# Altium schematic sheet MB_FPGA.SchDoc
size 420 x 297 mm; Date: 18/12/2022; ApprovedBy: UA3REO; CheckedBy: UA3REO; Author: RU4PN; CompanyName: Wolf Teams; DocumentNumber: Wolf2 MainBoard FPGA; SheetNumber: 2; SheetTotal: 7
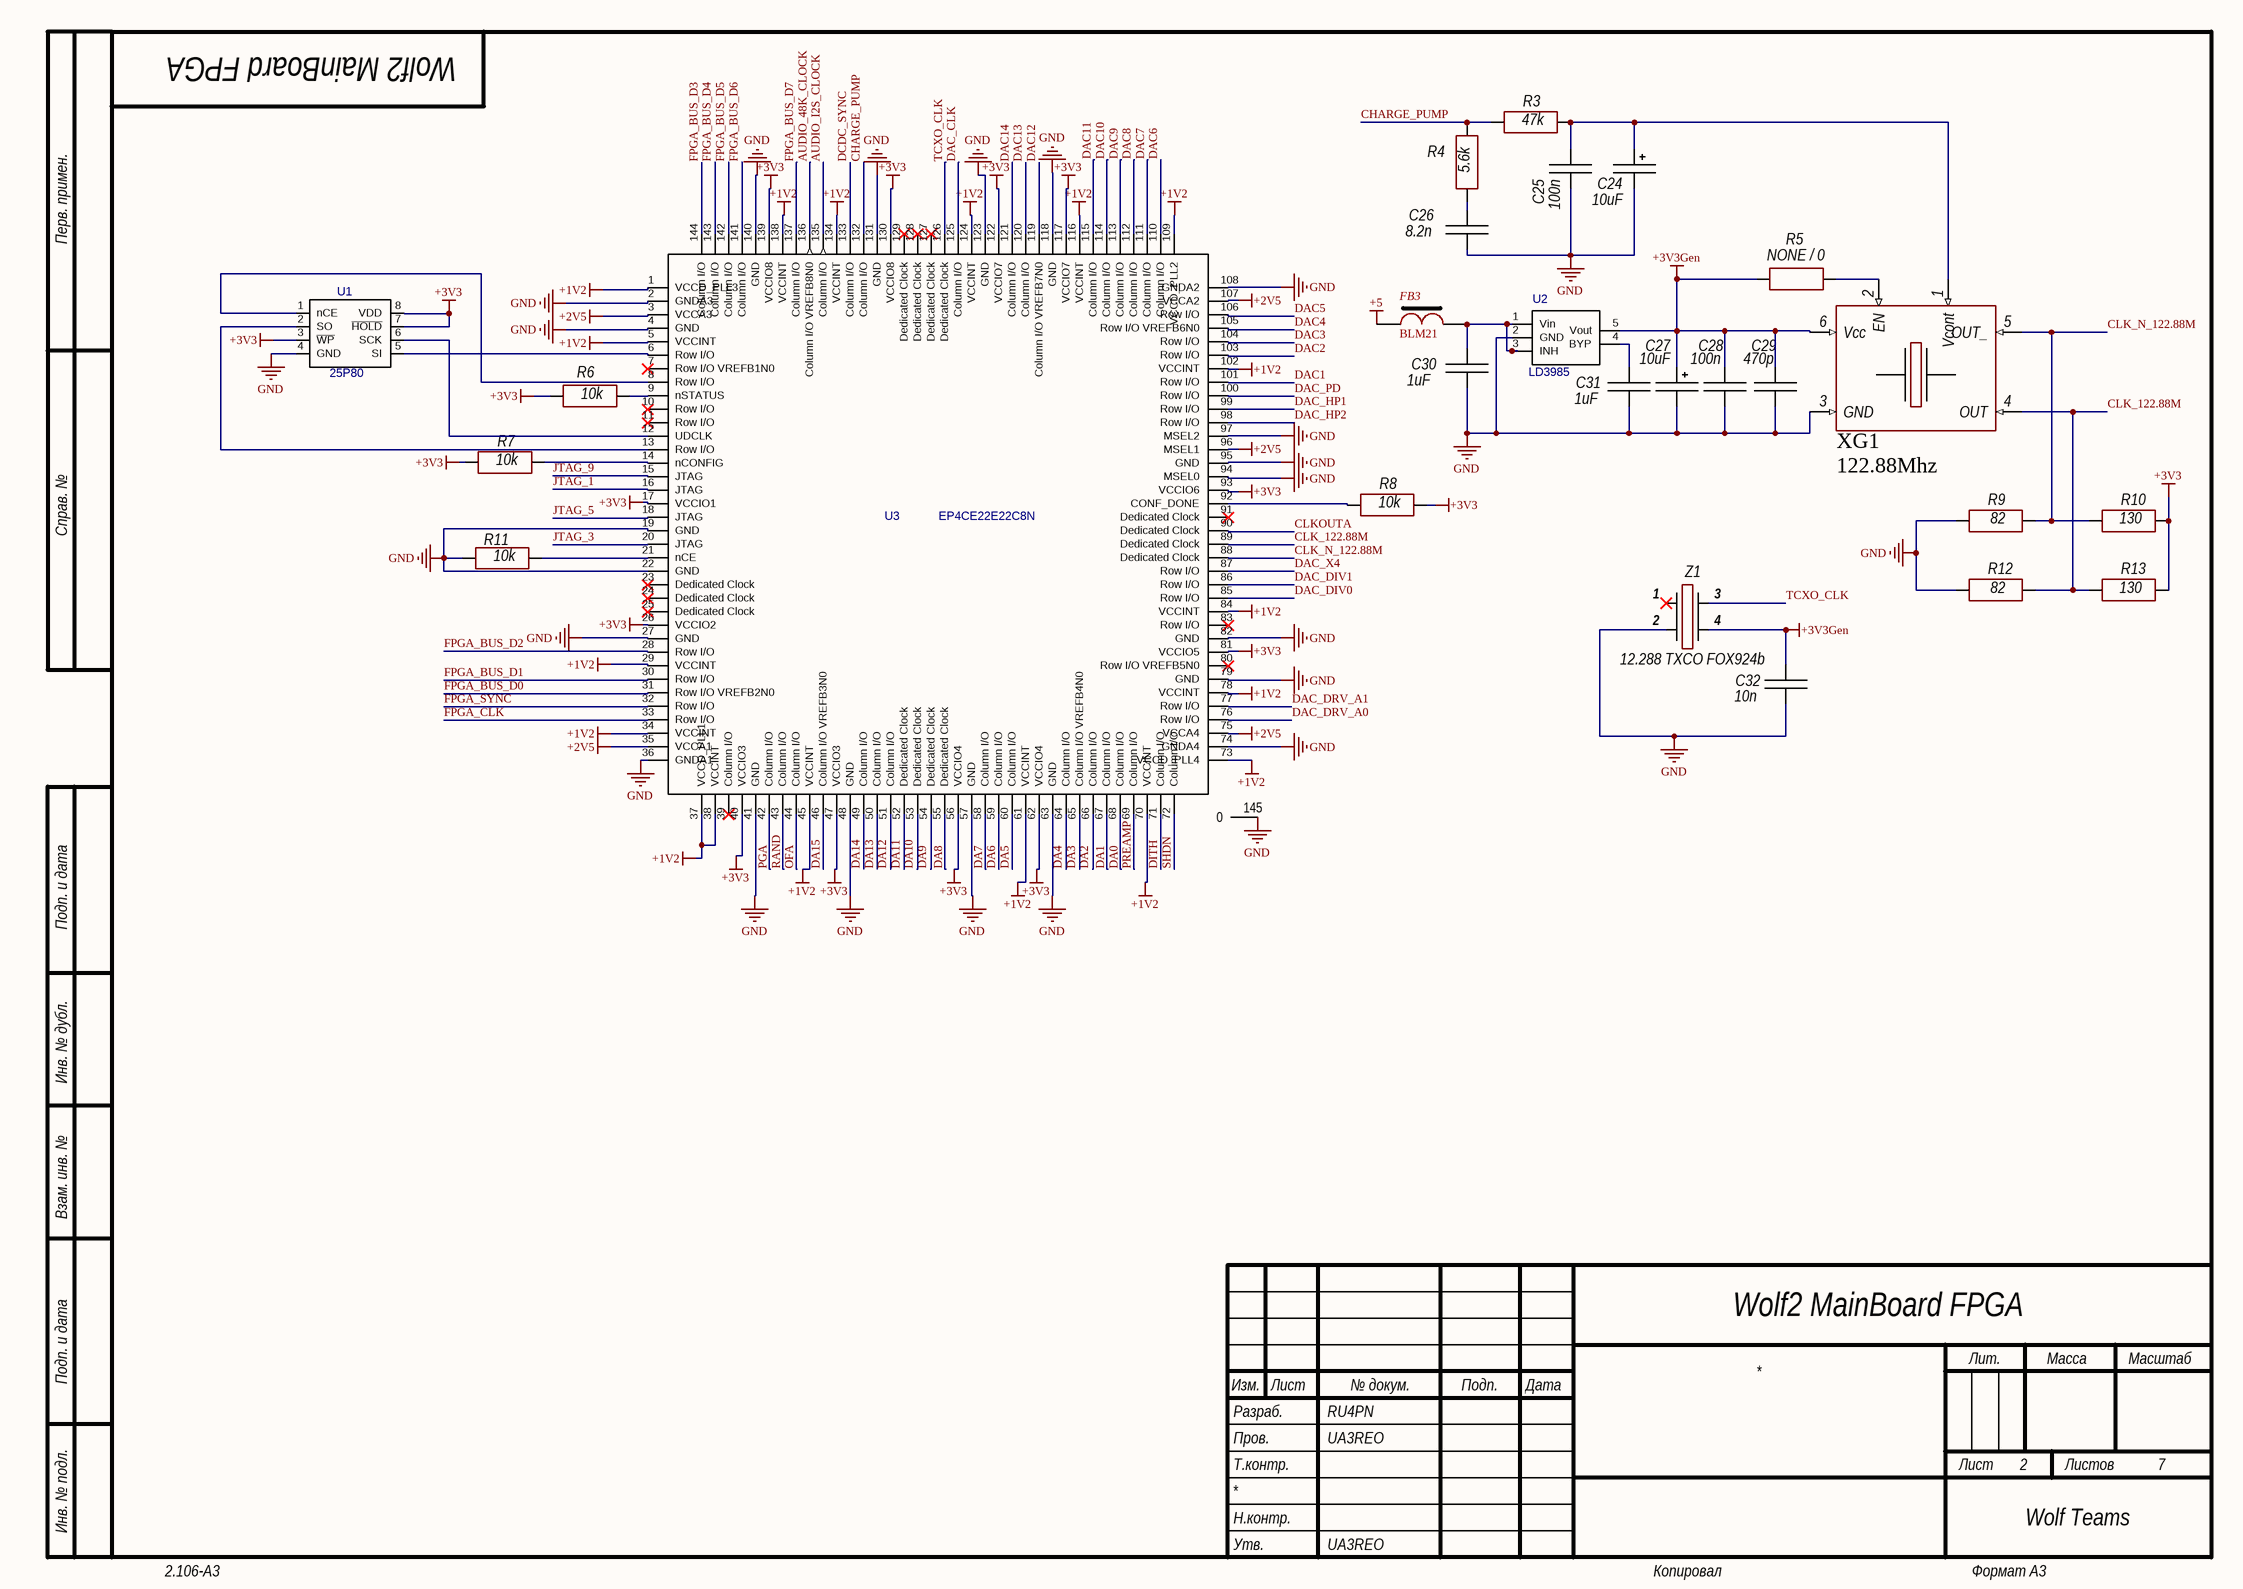
[diagram p0: MB_FPGA.SchDoc]

## Parts
C24  10uF  [TANTAL_B]
C25  100n  [CH0805C]
C26  8.2n  [CH0805C]
C27  10uF  [TANTAL_B]
C28  100n  [CH0805C]
C29  470p  [CH0805C]
C30  1uF  [CH0805C]
C31  1uF  [CH0805C]
C32  10n  [CH0805C]
FB3  BLM21  [CH0805L]
R3  47k  [CH0805R]
R4  5.6k  [CH0805R]
R5  NONE / 0  [CH0805R]
R6  10k  [CH0805R]
R7  10k  [CH0805R]
R8  10k  [CH0805R]
R9  82  [CH0805R]
R10  130  [CH0805R]
R11  10k  [CH0805R]
R12  82  [CH0805R]
R13  130  [CH0805R]
U1  25P80  [25P80]
U2  LD3985  [LD3985]
U3  EP4CE22E22C8N  [QFP144-20-2222A]
XG1  122.88Mhz  [OCS: GENA]
Z1  12.288 TXCO FOX924b  [TCXO]

## Nets
+1V2: U3.1(VCCD_PLL3) U3.5(VCCINT) U3.29(VCCINT) U3.34(VCCINT) U3.37(VCCD_PLL1) U3.38(VCCINT) U3.45(VCCINT) U3.61(VCCINT) U3.70(VCCINT) U3.73(VCCD_PLL4) U3.78(VCCINT) U3.84(VCCINT) U3.102(VCCINT) U3.109(VCCD_PLL2) U3.116(VCCINT) U3.124(VCCINT) U3.134(VCCINT) U3.138(VCCINT)
+2V5: U3.3(VCCA3) U3.35(VCCA1) U3.75(VCCA4) U3.96(MSEL1) U3.107(VCCA2)
+3V3: R6.2 R7.2 R8.1 R10.1 R13.1 U1.3(~{WP}) U1.7(~{HOLD}) U1.8(VDD) U3.17(VCCIO1) U3.26(VCCIO2) U3.40(VCCIO3) U3.47(VCCIO3) U3.56(VCCIO4) U3.62(VCCIO4) U3.81(VCCIO5) U3.93(VCCIO6) U3.117(VCCIO7) U3.122(VCCIO7) U3.130(VCCIO8) U3.139(VCCIO8)
+3V3Gen: C27.1 C28.1 C29.1 C32.1 R5.2 U2.5(Vout) XG1.6(Vcc) Z1.4
+5: FB3.2
GND: C24.2 C25.2 C26.2 C27.2 C28.2 C29.2 C30.2 C31.2 C32.2 R9.2 R11.2 R12.2 U1.4(GND) U2.2(GND) U3.2(GNDA3) U3.4(GND) U3.19(GND) U3.22(GND) U3.27(GND) U3.36(GNDA1) U3.41(GND) U3.48(GND) U3.57(GND) U3.63(GND) U3.74(GNDA4) U3.79(GND) U3.82(GND) U3.94(MSEL0) U3.95(GND) U3.97(MSEL2) U3.108(GNDA2) U3.118(GND) U3.123(GND) U3.131(GND) U3.140(GND) U3.145(0) XG1.3(GND) Z1.2
AUDIO_48K_CLOCK: U3.136(Column_I/O_VREFB8N0)
AUDIO_I2S_CLOCK: U3.135(Column_I/O)
CHARGE_PUMP: R3.2 R4.1 U3.132(Column_I/O)
CLK_122.88M: R12.1 R13.2 U3.89(Dedicated_Clock) XG1.4(OUT)
CLK_N_122.88M: R9.1 R10.2 U3.88(Dedicated_Clock) XG1.5(OUT_)
CLKOUTA: U3.90(Dedicated_Clock)
DA0: U3.68(Column_I/O)
DA1: U3.67(Column_I/O)
DA2: U3.66(Column_I/O)
DA3: U3.65(Column_I/O_VREFB4N0)
DA4: U3.64(Column_I/O)
DA5: U3.60(Column_I/O)
DA6: U3.59(Column_I/O)
DA7: U3.58(Column_I/O)
DA8: U3.55(Dedicated_Clock)
DA9: U3.54(Dedicated_Clock)
DA10: U3.53(Dedicated_Clock)
DA11: U3.52(Dedicated_Clock)
DA12: U3.51(Column_I/O)
DA13: U3.50(Column_I/O)
DA14: U3.49(Column_I/O)
DA15: U3.46(Column_I/O_VREFB3N0)
DAC1: U3.101(Row_I/O)
DAC2: U3.103(Row_I/O)
DAC3: U3.104(Row_I/O)
DAC4: U3.105(Row_I/O_VREFB6N0)
DAC5: U3.106(Row_I/O)
DAC6: U3.110(Column_I/O)
DAC7: U3.111(Column_I/O)
DAC8: U3.112(Column_I/O)
DAC9: U3.113(Column_I/O)
DAC10: U3.114(Column_I/O)
DAC11: U3.115(Column_I/O)
DAC12: U3.119(Column_I/O_VREFB7N0)
DAC13: U3.120(Column_I/O)
DAC14: U3.121(Column_I/O)
DAC_CLK: U3.125(Column_I/O)
DAC_DIV0: U3.85(Row_I/O)
DAC_DIV1: U3.86(Row_I/O)
DAC_DRV_A0: U3.76(Row_I/O)
DAC_DRV_A1: U3.77(Row_I/O)
DAC_HP1: U3.99(Row_I/O)
DAC_HP2: U3.98(Row_I/O)
DAC_PD: U3.100(Row_I/O)
DAC_X4: U3.87(Row_I/O)
DCDC_SYNC: U3.133(Column_I/O)
DITH: U3.71(Column_I/O)
FPGA_BUS_D0: U3.31(Row_I/O_VREFB2N0)
FPGA_BUS_D1: U3.30(Row_I/O)
FPGA_BUS_D2: U3.28(Row_I/O)
FPGA_BUS_D3: U3.144(Column_I/O)
FPGA_BUS_D4: U3.143(Column_I/O)
FPGA_BUS_D5: U3.142(Column_I/O)
FPGA_BUS_D6: U3.141(Column_I/O)
FPGA_BUS_D7: U3.137(Column_I/O)
FPGA_CLK: U3.33(Row_I/O)
FPGA_SYNC: U3.32(Row_I/O)
JTAG_1: U3.16(JTAG)
JTAG_3: U3.20(JTAG)
JTAG_5: U3.18(JTAG)
JTAG_9: U3.15(JTAG)
OFA: U3.44(Column_I/O)
PGA: U3.42(Column_I/O)
PREAMP: U3.69(Column_I/O)
RAND: U3.43(Column_I/O)
SHDN: U3.72(Column_I/O)
TCXO_CLK: U3.126(Dedicated_Clock) Z1.3
NetC24_1: C24.1 C25.1 R3.1 XG1.1(Vcont)
NetC26_1: C26.1 R4.2
NetC30_1: C30.1 FB3.1 U2.1(Vin) U2.3(INH)
NetC31_1: C31.1 U2.4(BYP)
NetR5_1: R5.1 XG1.2(EN)
NetR6_1: R6.1 U3.9(nSTATUS)
NetR7_1: R7.1 U3.14(nCONFIG)
NetR8_2: R8.2 U3.92(CONF_DONE)
NetR11_1: R11.1 U3.21(nCE)
NetU1_1: U1.1(nCE) U3.8(Row_I/O)
NetU1_2: U1.2(SO) U3.13(Row_I/O)
NetU1_5: U1.5(SI) U3.6(Row_I/O)
NetU1_6: U1.6(SCK) U3.12(UDCLK)

Not connected (* = marked no-connect by the designer): U3 7(Row_I/O_VREFB1N0)* 10(Row_I/O)* 11(Row_I/O)* 23(Dedicated_Clock)* 24(Dedicated_Clock)* 25(Dedicated_Clock)* 39(Column_I/O)* 80(Row_I/O_VREFB5N0)* 83(Row_I/O)* 91(Dedicated_Clock)* 127(Dedicated_Clock)* 128(Dedicated_Clock)* 129(Dedicated_Clock)*; Z1 1*

## Notes on the sheet
- Перв. примен.
- Справ. №
- Подп. и дата
- Инв. № дубл.
- Взам. инв. №
- Разраб.
- Изм.
- Лист
- № докум.
- Подп.
- Дата
- Лит.
- Масса
- Масштаб
- Пров.
- Т.контр.
- Листов
- Инв. № подл.
- Утв.
- Н.контр.
- 2.106-A3
- Копировал
- Формат А3

## Library data of the parts
C24 C27 = TantalCap: Manufacturer: *; Model: *; HelpURL: *; ComponentKind: *; Value: *
C25 C26 C28-C32 = Capacitor: Manufacturer: *; Model: *; HelpURL: *; ComponentKind: *; Value: *
FB3 = FB-1
R3-R13 = Resistor: Manufacturer: *; Model: *; HelpURL: *; ComponentKind: *; Value: *
XG1 = NV7050SA: Generator
Z1 = Generator: Manufacturer: *; Model: *; HelpURL: *; ComponentKind: *; Value: *
U1 = 25P80: Value: 25P80
U2 = LD3985: Value: LD3985
U3 = EP4CE22E22C8N: Value: EP4CE22E22C8N